# Altium schematic sheet 06_MicroSD_Card.SchDoc
size 297 x 209 mm
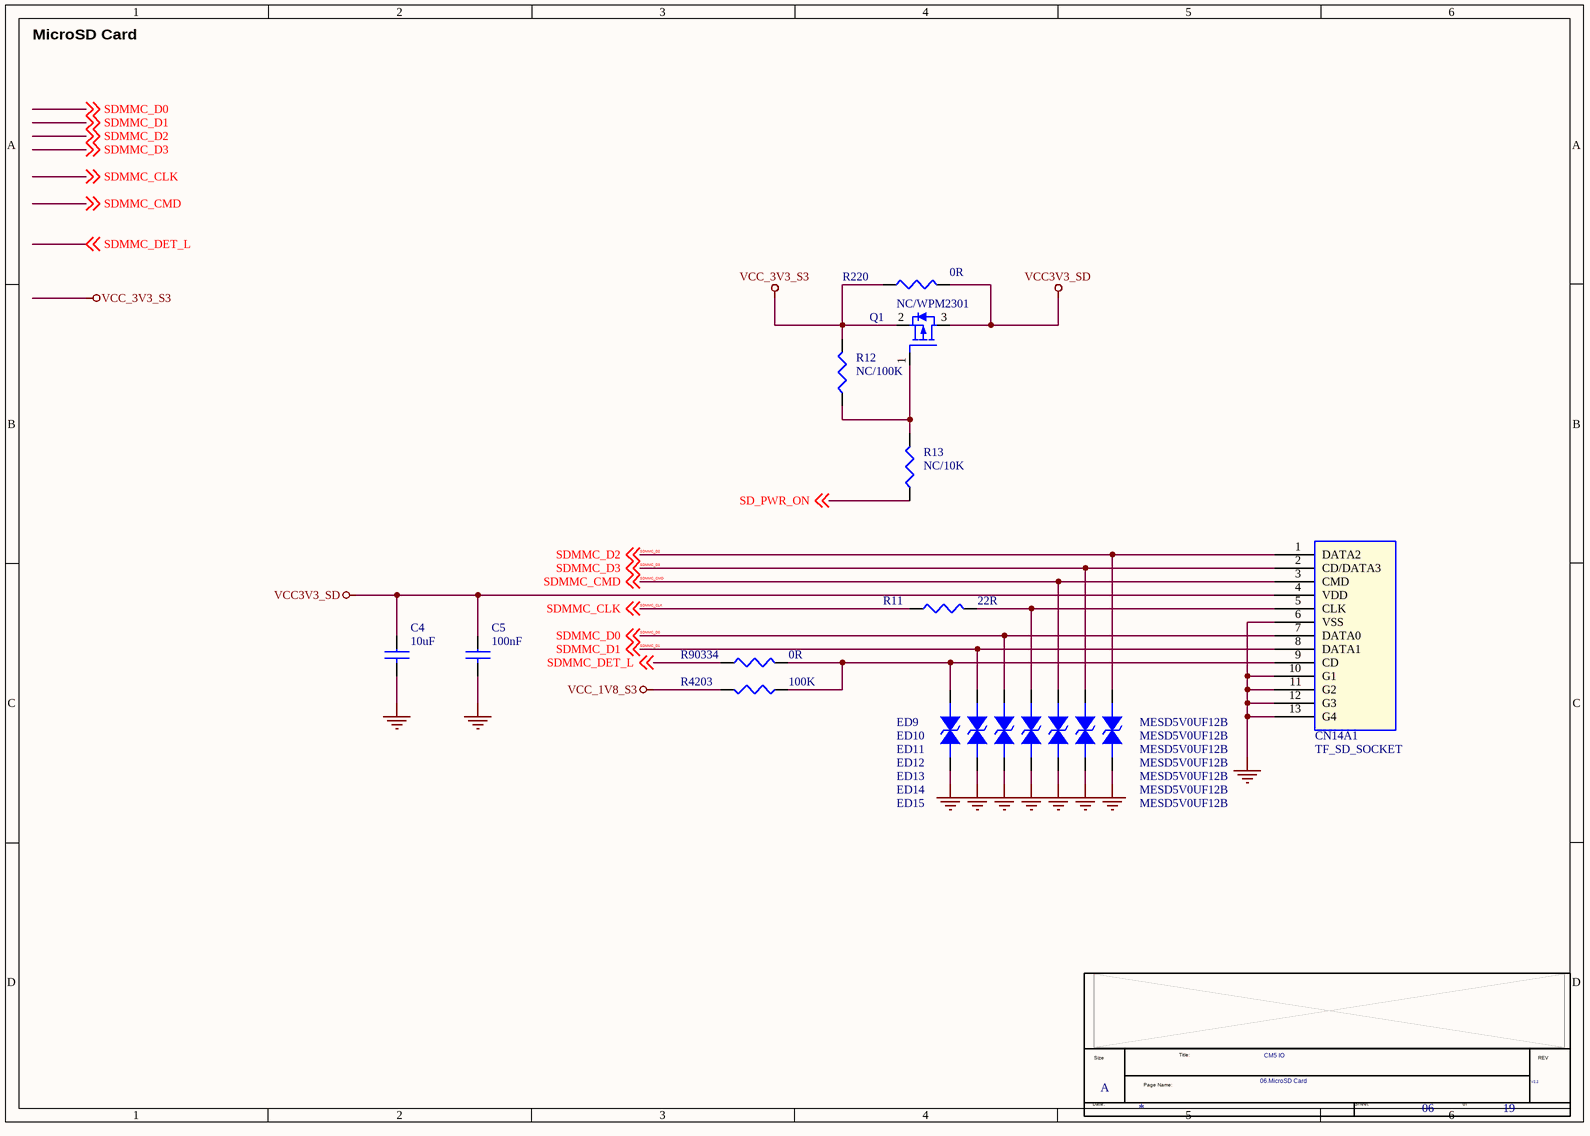
[diagram p0: 06_MicroSD_Card.SchDoc]

## Parts
*  Doc: 06.MicroSD Card  RevCode: V2.2  Title: CM5 IO  Page Size: A  Page Number: 06  Page Count: 19  (hidden comment: radxa_1010)  (graphical)
C4  10uF  [C0603]
C5  100nF  [C0402]
CN14A1  TF_SD_SOCKET  [TF-CKT01-009D]
ED9  MESD5V0UF12B  [E0402N]
ED10  MESD5V0UF12B  [E0402N]
ED11  MESD5V0UF12B  [E0402N]
ED12  MESD5V0UF12B  [E0402N]
ED13  MESD5V0UF12B  [E0402N]
ED14  MESD5V0UF12B  [E0402N]
ED15  MESD5V0UF12B  [E0402N]
Q1  NC/WPM2301  [SOT23]
R11  22R  [R0402]
R12  NC/100K  [R0402]
R13  NC/10K  [R0402]
R220  0R  [R0402]
R4203  100K  [R0402]
R90334  0R  [R0402]

## Nets
GND: C4.2 C5.2 CN14A1.6(VSS) CN14A1.10(G1) CN14A1.11(G2) CN14A1.12(G3) CN14A1.13(G4) ED9.2 ED10.2 ED11.2 ED12.2 ED13.2 ED14.2 ED15.2
VCC3V3_SD: C4.1 C5.1 CN14A1.4(VDD) Q1.3(DRAIN) R220.2
VCC_1V8_S3: R4203.2
VCC_3V3_S3: Q1.2(SOURCE) R12.1 R220.1
SD_PWR_ON: R13.2 ; off-sheet SD_PWR_ON
SDMMC_CLK: R11.1 ; off-sheet SDMMC_CLK
SDMMC_CMD: CN14A1.3(CMD) ED13.1 ; off-sheet SDMMC_CMD
SDMMC_D0: CN14A1.7(DATA0) ED11.1 ; off-sheet SDMMC_D0
SDMMC_D1: CN14A1.8(DATA1) ED10.1 ; off-sheet SDMMC_D1
SDMMC_D2: CN14A1.1(DATA2) ED15.1 ; off-sheet SDMMC_D2
SDMMC_D3: CN14A1.2(CD/DATA3) ED14.1 ; off-sheet SDMMC_D3
SDMMC_DET_L: R90334.1 ; off-sheet SDMMC_DET_L
NetCN14A1_5: CN14A1.5(CLK) ED12.1 R11.2
NetCN14A1_9: CN14A1.9(CD) ED9.1 R4203.1 R90334.2
NetQ1_1: Q1.1(GATE) R12.2 R13.1

## Notes on the sheet
- MicroSD Card
- (in symbol radxa_1010) Size; Title:; REV; Page Name:; Date:; Sheet; of

## Library data of the parts
C4 = CAP NP_0: cap,10.00uF,+/-10%,10V,X5R,C0603; Manufacturer PN: C1608X5R1A106K080AC; Manufacturer: TDK; Tolerance: 10%; C_Voltage: 6.3V; Priority: A; Voltage: 10V; PCB Footprint: C0603; Dielectric: X5R; Created by: JJJ; Part Type: C0603; RK PN: C1608X5R1A106K080AC
C5 = CAP NP_0: cap,100.00nF,+/-10%,10V,X5R,C0402; Manufacturer PN: C1005X5R1A104K050BA; Manufacturer: TDK; C_Voltage: 6.3V; Tolerance: 10%; Priority: A; Voltage: 10V; PCB Footprint: C0402; Dielectric: X5R; Created by: JJJ; Part Type: C0402; RK PN: C1005X5R1A104K050BA
CN14A1 = SD_SOCKET_0: PCB Footprint: TF-CKT01-009D
ED9-ED15 = DIODE BI-DIR TRIG: ESD; PCB Footprint: E0402N
Q1 = MOSFET P: PMOS,WPM3407-3/TR,SOT_23,Id=4.4A,Vds=30V; Manufacturer: WillSemi(韦尔半导体); Pd: 0.9W; Vgsth: 2.0V; VDS: 30V; Vgs: ±20V; Id_max: 4.4A; Priority: A; PCB Footprint: SOT23; Created by: JJJ; Manufacturer PN: WPM3407-3/TR; Part Type: PMOS; RK PN: WPM3407-3/TR
R11 = RESISTOR_1_Dup2: PCB Footprint: R0402
R12 = RESISTOR_0_Dup3: 通用厚膜电阻,100K,+/-5%,R0402,1/16W.; Manufacturer: YAGEO; Tolerance: 5%; RK PN: RC0402JR-07100KL; Priority: A; Wattage: 1/16W; PCB Footprint: R0402; Part Type: 通用厚膜电阻; Manufacturer PN: RC0402JR-07100KL; Created by: YTL
R13 = RESISTOR_0_Dup3: 通用厚膜电阻,10K,+/-5%,R0402,1/16W.; Manufacturer PN: RC0402JR-0710KL; Manufacturer: YAGEO; Tolerance: 5%; Wattage: 1/16W; Priority: A; PCB Footprint: R0402; Created by: YTL; Part Type: 通用厚膜电阻; RK PN: RC0402JR-0710KL
R220 = RESISTOR_0_Dup3: 通用厚膜电阻,0R,+/-5%,R0402,1/16W.; Manufacturer: YAGEO; Tolerance: 5%; PCB Footprint: R0603; RK PN: RC0402JR-070RL; Priority: A; Wattage: 1/16W; Part Type: 通用厚膜电阻; Manufacturer PN: RC0402JR-070RL; Created by: YTL
R4203 = RESISTOR_1: 通用厚膜电阻,100K,+/-5%,R0402,1/16W.; Manufacturer PN: RC0402JR-07100KL; Manufacturer: YAGEO; Tolerance: 5%; Wattage: 1/16W; Priority: A; PCB Footprint: R0402; Created by: YTL; Part Type: 通用厚膜电阻; RK PN: RC0402JR-07100KL
R90334 = RESISTOR_0_Dup2: 通用厚膜电阻,0R,+/-5%,R0402,1/16W.; Manufacturer PN: RC0402JR-070RL; Manufacturer: YAGEO; Tolerance: 5%; Wattage: 1/16W; Priority: A; PCB Footprint: R0402; Created by: YTL; Part Type: 通用厚膜电阻; RK PN: RC0402JR-070RL
* = radxa_1010: Page Create Date: March  8, 1995; Page Modify Date: *